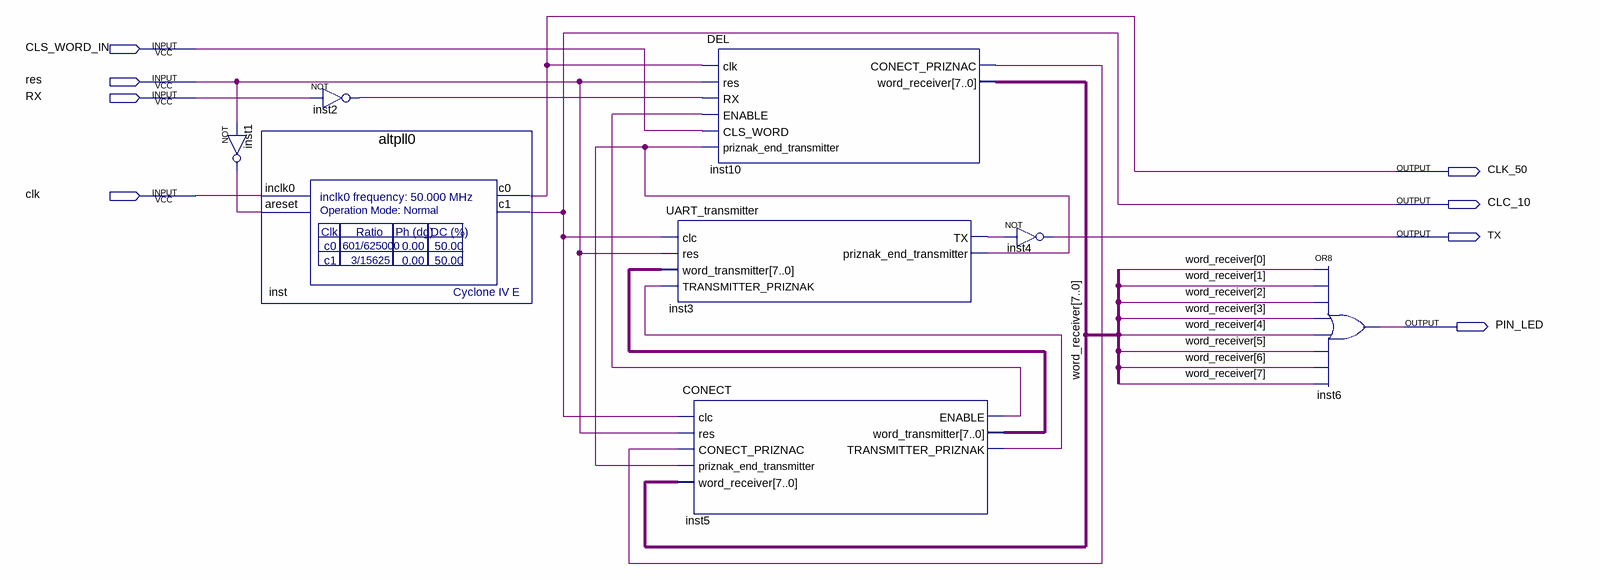
[diagram p0: schematic sheet]
// Quartus schematic all_uart.bdf as structural Verilog: 8 symbols, 8 pins
module all_uart (
  input  CLS_WORD_IN,
  input  res,
  input  RX,
  input  clk,
  output CLK_50,
  output CLC_10,
  output TX,
  output PIN_LED
);

  wire inst1_out, inst2_out, inst3_priznak_end_transmitter, inst3_tx, inst5_enable,
       inst5_transmitter_priznak, inst10_conect_priznac;
  wire [7:0] inst5_word_transmitter, word_receiver;

  not inst1 (inst1_out, res);
  altpll0 inst (.inclk0(clk), .areset(inst1_out), .c0(CLK_50), .c1(CLC_10));
  not inst2 (inst2_out, RX);
  UART_transmitter inst3 (
    .clc(CLC_10), .res(res), .word_transmitter(inst5_word_transmitter),
    .TRANSMITTER_PRIZNAK(inst5_transmitter_priznak), .TX(inst3_tx),
    .priznak_end_transmitter(inst3_priznak_end_transmitter));
  DEL inst10 (
    .clk(CLK_50), .res(res), .RX(inst2_out), .ENABLE(inst5_enable), .CLS_WORD(CLS_WORD_IN),
    .priznak_end_transmitter(inst3_priznak_end_transmitter), .CONECT_PRIZNAC(inst10_conect_priznac),
    .word_receiver(word_receiver));
  CONECT inst5 (
    .clc(CLC_10), .res(res), .CONECT_PRIZNAC(inst10_conect_priznac),
    .priznak_end_transmitter(inst3_priznak_end_transmitter), .word_receiver(word_receiver),
    .ENABLE(inst5_enable), .word_transmitter(inst5_word_transmitter),
    .TRANSMITTER_PRIZNAK(inst5_transmitter_priznak));
  not inst4 (TX, inst3_tx);
  or inst6 (PIN_LED, word_receiver[0], word_receiver[1], word_receiver[2], word_receiver[3], word_receiver[4], word_receiver[5], word_receiver[6], word_receiver[7]);
endmodule
